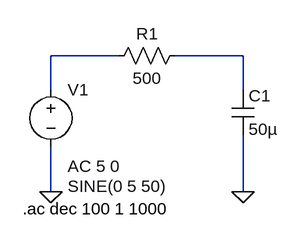
[diagram p0: schematic low_pass_filter.asc]
low_pass_filter.asc, the LTspice schematic file:
Version 4.1
SHEET 1 880 680
WIRE 176 64 80 64
WIRE 352 64 256 64
WIRE 80 112 80 64
WIRE 352 112 352 64
WIRE 80 256 80 192
WIRE 352 256 352 176
FLAG 80 256 0
FLAG 352 256 0
SYMBOL voltage 80 96 R0
WINDOW 3 24 152 Left 2
WINDOW 123 24 124 Left 2
WINDOW 39 0 0 Left 0
SYMATTR Value SINE(0 5 50)
SYMATTR Value2 AC 5 0
SYMATTR InstName V1
SYMBOL res 272 48 R90
WINDOW 0 0 56 VBottom 2
WINDOW 3 32 56 VTop 2
SYMATTR InstName R1
SYMATTR Value 500
SYMBOL cap 336 112 R0
SYMATTR InstName C1
SYMATTR Value 50µ
TEXT 40 280 Left 2 !.ac dec 100 1 1000

The netlist it stands for:
* low_pass_filter.asc
V1 N001 0 SINE(0 5 50) AC 5 0
R1 N002 N001 500
C1 N002 0 50µ
.ac dec 100 1 1000
.backanno
.end